# Altium project boost_converter_circuit.PrjPcb
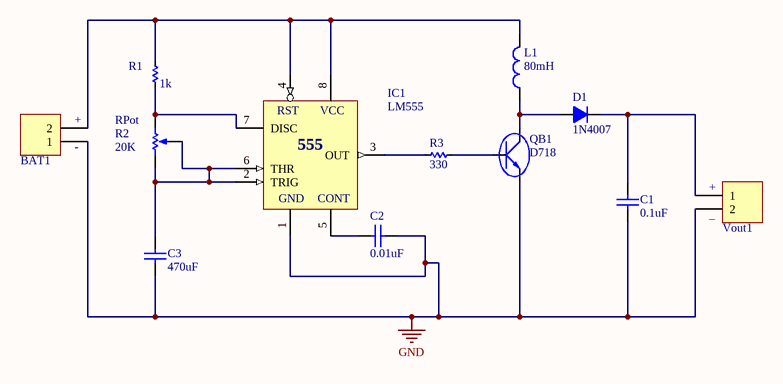
[diagram p0: principle_diagram_boost_converter.SchDoc]
1 sheet, 12 parts. Net scope: global (net labels, ports and power ports of the same name join across sheets).
Board file: print_circute_boost_converter.PcbDoc

## Sheet principle_diagram_boost_converter.SchDoc
size A4

### Parts
BAT1  Header 2_1  [HED2]  (value not drawn)
C1  value 0.1uF  [Cap Non-Pol 3mm]  (hidden comment: Cap Non-pol)
C2  value 0.01uF  [Cap Non-Pol 3mm]  (hidden comment: Cap Non-pol)
C3  value 470uF  [Cap Non-Pol 3mm]  (hidden comment: Cap Non-pol)
D1  1N4007  [D2A]
IC1  LM555  [DIP8]
L1  80mH  [L/0.4]
QB1  D718  [QTO-247]
R1  1k  [RES-1/4W]
R2  RPot  value 20K  [VR5]
R3  330  [RES-1/4W]
Vout1  Header 2_1  [HED2]  (value not drawn)

### Nets
GND: BAT1.1 C1.1 C2.1 C3.1 IC1.1(GND) QB1.3(E) Vout1.2
NetBAT1_2: BAT1.2 IC1.4(RST) IC1.8(VCC) L1.2 R1.2
NetC1_2: C1.2 D1.2(K) Vout1.1
NetC2_2: C2.2 IC1.5(CONT)
NetC3_2: C3.2 IC1.2(TRIG) IC1.6(THR) R2.1(TOP) R2.3(TAP)
NetD1_1: D1.1(A) L1.1 QB1.2(C)
NetIC1_3: IC1.3(OUT) R3.2
NetIC1_7: IC1.7(DISC) R1.1 R2.2(BOT)
NetQB1_1: QB1.1(B) R3.1

### Notes on the sheet
- (near BAT1) +
- (near BAT1) -
- (near Vout1) +
- (near Vout1) _
- (in symbol LM555) 555

### Library data of the parts
BAT1 Vout1 = Header 2_1: Header, 2-Pin; Manufacturer: Generic Components; Class: Connector; Value: Header 2
C1-C3 = Cap Non-pol: Non-polarized Capacitor; Published: 8-Jun-2000; LatestRevisionDate: 17-Jul-2002; LatestRevisionNote: Re-released for DXP Platform.; PackageReference: RAD-0.3; Publisher: Altium Limited
D1 = D1A: Diode 1A; Value: 1N4007
IC1 = LM555: Timer; Value: LM555
L1 = L1: Inductor; Value: 150 mH
QB1 = D718_1: Transistor Power Supply; Value: D718
R1 R3 = Res: Manufacturer: Generic Components; Class: Passive; SubClass: R; Published: 08/06/2000; Publisher: Altium Hobart Technology Centre
R2 = RPot: Potentiometer; Sim Note: Enter the Resistance value and the set point into parameter fields.; Set Position: 0.5; Published: 8-Jun-2000; LatestRevisionDate: 17-Jul-2002; LatestRevisionNote: Re-released for DXP Platform.; PackageReference: VR5; Publisher: Altium Limited; PackageDescription: Variable Resistor, Thru-Hole; 3 Leads